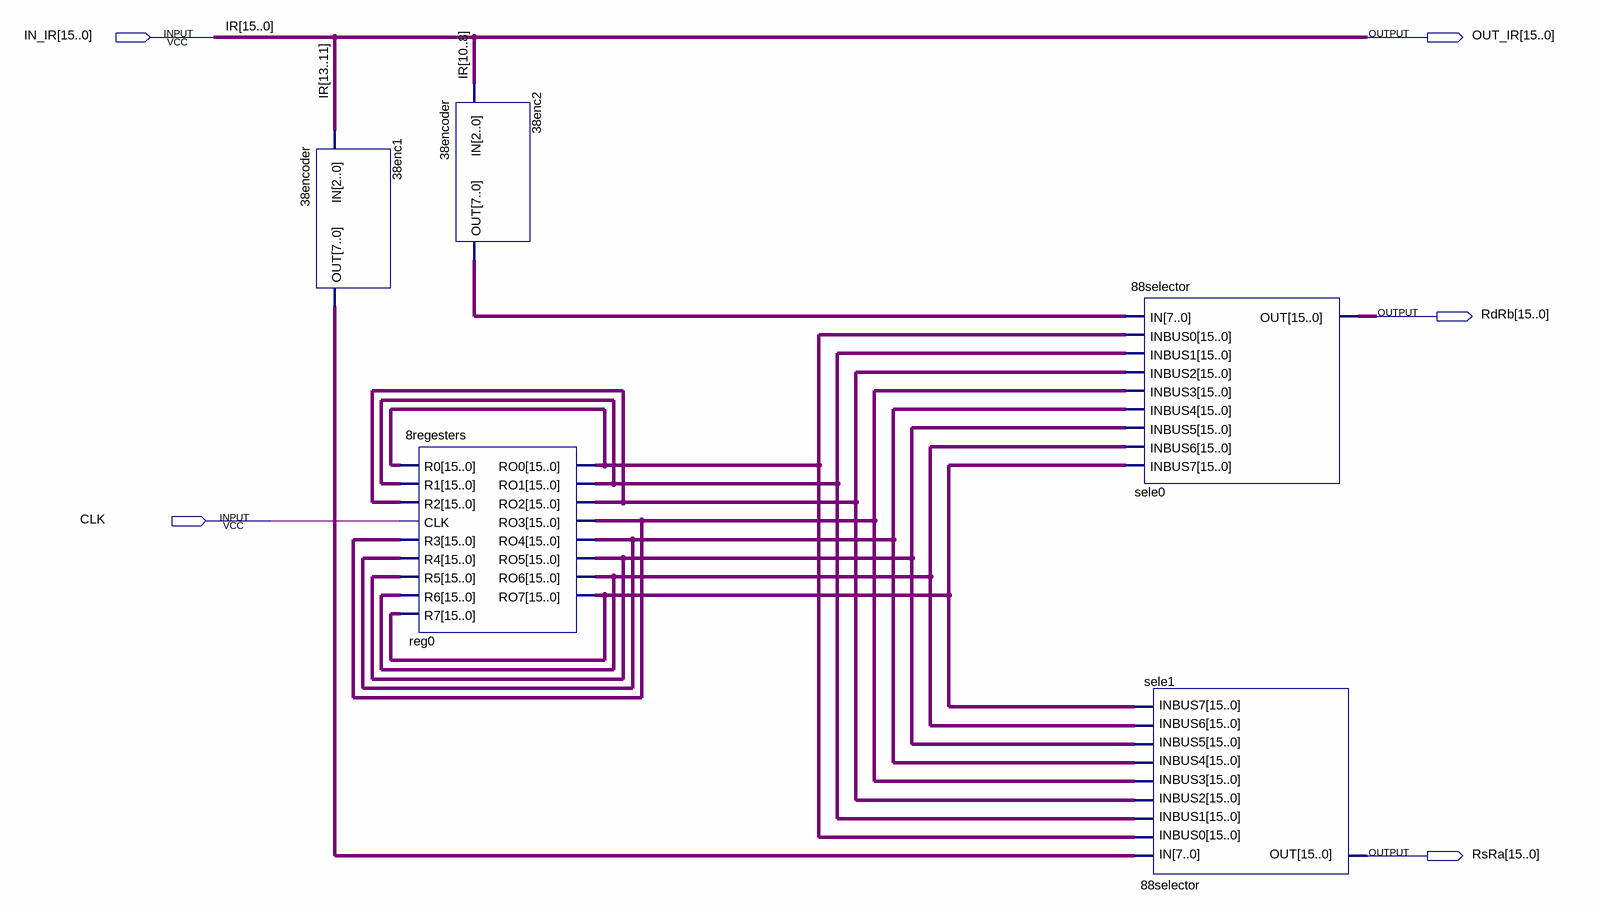
[diagram p0: schematic sheet]
// Quartus schematic phaze2.bdf as structural Verilog: 5 symbols, 5 pins
module phaze2 (
  input  [15:0] IN_IR,
  input  CLK,
  output [15:0] OUT_IR,
  output [15:0] RdRb,
  output [15:0] RsRa
);

  wire [7:0] n38enc1_out, n38enc2_out;
  wire [15:0] reg0_ro0, reg0_ro1, reg0_ro2, reg0_ro3, reg0_ro4, reg0_ro5, reg0_ro6, reg0_ro7;

  \38encoder  u_38enc1 (.IN(IN_IR[13:11]), .OUT(n38enc1_out));
  \38encoder  u_38enc2 (.IN(IN_IR[10:8]), .OUT(n38enc2_out));
  \8regesters  reg0 (
    .R0(reg0_ro0), .R1(reg0_ro1), .R2(reg0_ro2), .CLK(CLK), .R3(reg0_ro3), .R4(reg0_ro4), .R5(reg0_ro5),
    .R6(reg0_ro6), .R7(reg0_ro7), .RO0(reg0_ro0), .RO1(reg0_ro1), .RO2(reg0_ro2), .RO3(reg0_ro3),
    .RO4(reg0_ro4), .RO5(reg0_ro5), .RO6(reg0_ro6), .RO7(reg0_ro7));
  \88selector  sele0 (
    .IN(n38enc2_out), .INBUS0(reg0_ro0), .INBUS1(reg0_ro1), .INBUS2(reg0_ro2), .INBUS3(reg0_ro3),
    .INBUS4(reg0_ro4), .INBUS5(reg0_ro5), .INBUS6(reg0_ro6), .INBUS7(reg0_ro7), .OUT(RdRb));
  \88selector  sele1 (
    .IN(n38enc1_out), .INBUS0(reg0_ro0), .INBUS1(reg0_ro1), .INBUS2(reg0_ro2), .INBUS3(reg0_ro3),
    .INBUS4(reg0_ro4), .INBUS5(reg0_ro5), .INBUS6(reg0_ro6), .INBUS7(reg0_ro7), .OUT(RsRa));

  assign OUT_IR = IN_IR;

  // Other names for the same wires on the sheet: IR[15:0] = IN_IR
endmodule
